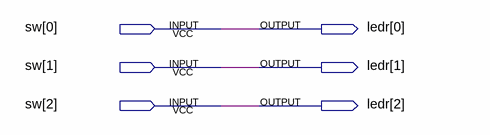
[diagram p0: schematic sheet]
// Quartus schematic Switch.bdf as structural Verilog: 0 symbols, 6 pins
module Switch (
  input  [2:0] sw,
  output [2:0] ledr
);


  assign ledr = sw;
endmodule
